# EasyEDA Pro project power_board_24v.epro

# Schematic Power_board_24V
Board Name: Power_board_24V_1; Create Date: 2025-07-09; Page Name: P1; Project Name: metaball; Schematic Name: Power_board_24V_1; Update Date: 2025-07-09; Company: 嘉立创EDA; Drawed: Xudong Han; Page Size: A4; Version: V1.0
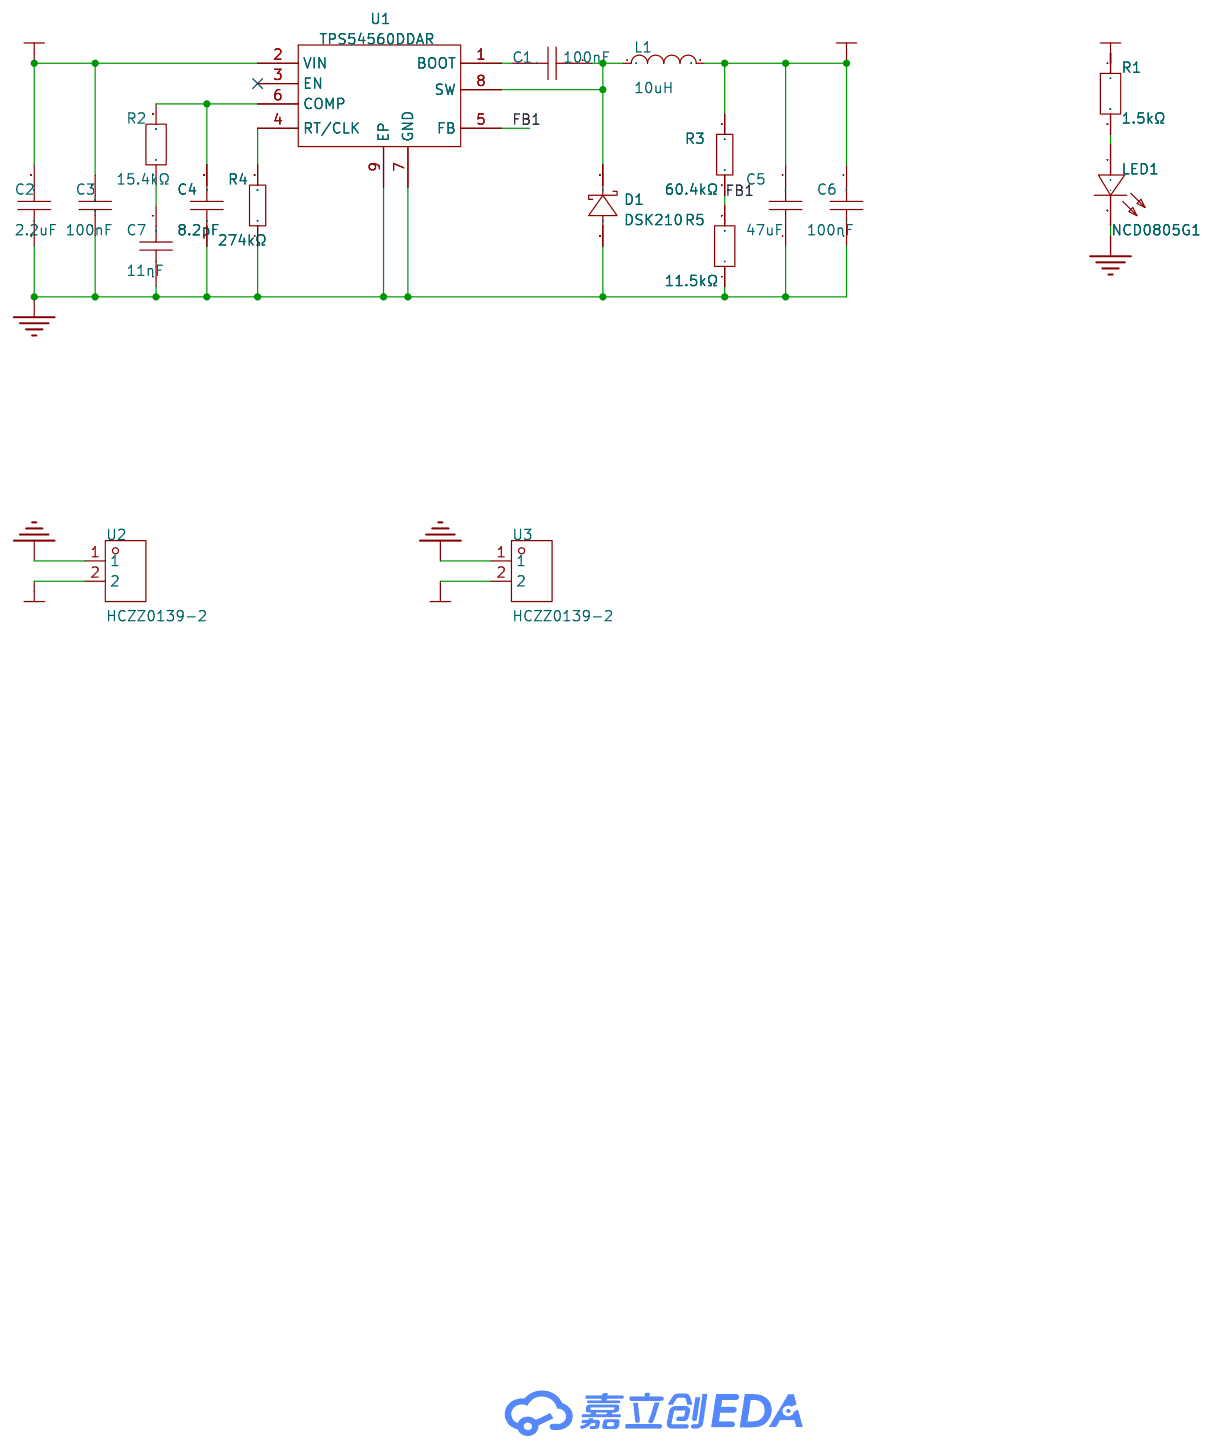
[diagram p0: schematic sheet]

## Parts
C1  100nF  [C0603]
C2  2.2uF  [C0805]
C3  100nF  [C0603]
C4  8.2pF  [C0603]
C5  47uF  [C0805]
C6  100nF  [C0603]
C7  11nF  [C0805]
D1  DSK210  [SOD-123FL_L2.7-W1.8-LS3.8-RD]
L1  10uH  [IND-SMD_L2.5-W2.0_FHD252012S-6R8MT]
LED1  NCD0805G1  [LED0805-R-RD]
R1  1.5kΩ  [R0603]
R2  15.4kΩ  [R0603]
R3  60.4kΩ  [R0603]
R4  274kΩ  [R0603]
R5  11.5kΩ  [R0603]
U1  TPS54560DDAR  [SOIC-8_L5.0-W4.0-P1.27-LS6.0-BL-EP2.0]
U2  HCZZ0139-2  [CONN-TH_2P-P2.50_HCZZ0139-2]
U3  HCZZ0139-2  [CONN-TH_2P-P2.50_HCZZ0139-2]

## Library data of the parts
C1 C6 = CGA0603X7R104K500JT: 容值:100nF;精度:±10%;额定电压:50V;材质(温度系数):X7R;; LCSC Part Name: 100nF ±10% 50V; Supplier Part: C6119867; Manufacturer: HRE(芯声); Supplier Footprint: 0603; JLCPCB Part Class: 扩展库; Supplier: LCSC; Tolerance: ±10%; Voltage Rated: 50V; Temperature Coefficient: X7R
C2 = CL21A225KBQNNNE: 容值:2.2uF;精度:±10%;额定电压:50V;材质(温度系数):X5R;; LCSC Part Name: 2.2uF ±10% 50V; Supplier Part: C377773; Manufacturer: SAMSUNG(三星); Supplier Footprint: 0805; JLCPCB Part Class: Basic Part; Datasheet: https://atta.szlcsc.com/upload/public/pdf/source/20160218/1457707763339.pdf; Supplier: LCSC; Tolerance: ±10%; Voltage Rated: 50V; Temperature Coefficient: X5R
C3 = CGA0603X7R104K500JT: 容值:100nF;精度:±10%;额定电压:50V;温度系数:X7R;; LCSC Part Name: 100nF ±10% 50V; Supplier Part: C6119867; Manufacturer: HRE(芯声); Supplier Footprint: 0603; JLCPCB Part Class: Extended Part; Datasheet: https://atta.szlcsc.com/upload/public/pdf/source/20250103/C44077DA9E7B3EFAE02F22B6D3D1CBC9.pdf; Supplier: LCSC; Tolerance: ±10%; Voltage Rated: 50V; Temperature Coefficient: X7R; Voltage Rating: 50V
C4 = FCC0603N8R2C500CT: 容值:8.2pF;额定电压:50V;材质(温度系数):C0G;; LCSC Part Name: 8.2pF 50V ±0.25pF; Supplier Part: C5137629; Manufacturer: FOJAN(富捷); Supplier Footprint: 0603; JLCPCB Part Class: 扩展库; Datasheet: https://atta.szlcsc.com/upload/public/pdf/source/20220818/0EB3B7FB2F5648AC16609637FBA7DABE.pdf; Supplier: LCSC; Voltage Rated: 50V; Temperature Coefficient: C0G
C5 = CGA0805X5R476M100MT: 容值:47uF;精度:±20%;额定电压:10V;材质(温度系数):X5R;; LCSC Part Name: 47uF ±20% 10V; Supplier Part: C6119904; Manufacturer: HRE(芯声); Supplier Footprint: 0805; JLCPCB Part Class: 扩展库; Supplier: LCSC; Tolerance: ±20%; Voltage Rated: 10V; Temperature Coefficient: X5R
C7 = GRM2195C1H113JA01D: 容值:11nF;精度:±5%;额定电压:50V;材质(温度系数):C0G;; LCSC Part Name: 11nF ±5% 50V; Supplier Part: C710944; Manufacturer: muRata(村田); Supplier Footprint: 0805; JLCPCB Part Class: 扩展库; Datasheet: https://atta.szlcsc.com/upload/public/pdf/source/20230811/93180086841D94E3B53FBD771E074624.pdf; Supplier: LCSC; Tolerance: ±5%; Voltage Rated: 50V; Temperature Coefficient: C0G
D1 = DSK210_C7502713: 二极管配置:独立式;正向压降(Vf):850mV@2A;直流反向耐压(Vr):100V;整流电流:2A;; LCSC Part Name: 电压:100V 电流:2A; Supplier Part: C7502713; Manufacturer: 宏迦橙; Supplier Footprint: SOD-123FL; JLCPCB Part Class: Extended Part; Datasheet: https://atta.szlcsc.com/upload/public/pdf/source/20240814/18366EFEA8C1355349286254791BE851.pdf; Supplier: LCSC; Diode Configuration: 独立式; Forward Voltage (Vf@If): 850mV@2A; Reverse Voltage (Vr): 100V; Rectified Current: 2A; Reverse Leakage Current (Ir): 500uA
L1 = FHD252012S-100MT: 电感值:10uH;精度:±20%;额定电流:1A;饱和电流(Isat):1.35A;类型:绕线电感;; LCSC Part Name: 10uH ±20% 1.35A; Supplier Part: C602018; Manufacturer: cjiang(长江微电); Supplier Footprint: 1008; JLCPCB Part Class: Extended Part; Datasheet: https://atta.szlcsc.com/upload/public/pdf/source/20200609/C601990_BCEA243EC4DA0A9A288AA78A6DFB48A5.pdf; Supplier: LCSC; Tolerance: ±20%; Current Rating: 1A; Current - Saturation(Isat): 1.35A; DC Resistance(DCR): 435mΩ; Type: 绕线电感
LED1 = NCD0805G1: 发光颜色:翠绿色;正向电压(VF):2.5V~3.6V;功率:72mW;正向电流:5mA;主波长:525nm~537.5nm;透镜颜色:无色透明透镜;发光强度:180mcd~400mcd;发光角度:130°;工作温度:-30℃~+85℃;; Supplier Part: C84260; Manufacturer: 国星光电; Supplier Footprint: 0805; JLCPCB Part Class: Extended Part; Datasheet: https://atta.szlcsc.com/upload/public/pdf/source/20200820/C84260_AFC7BF57C6FBA034D182BB8D10A67EFE.pdf; Supplier: LCSC; Emitted Color: 翠绿色; Forward Voltage (VF): 2.5V~3.6V; Power Dissipation: 72mW; Forward Current: 5mA; Dominant Wavelength: 525nm~537.5nm; Lens Color: 无色透明透镜; Luminous Intensity: 180mcd~400mcd; Viewing Angle: 130°; Operating Temperature: -30℃~+85℃
R1 = 0603WAF1501T5E: 电阻类型:厚膜电阻;阻值:1.5kΩ;精度:±1%;功率:100mW;最大工作电压:75V;温度系数:±100ppm/℃;; LCSC Part Name: 1.5kΩ ±1% 100mW 厚膜电阻; Supplier Part: C22843; Manufacturer: UNI-ROYAL(厚声); Supplier Footprint: 0603; JLCPCB Part Class: Basic Part; Datasheet: https://atta.szlcsc.com/upload/public/pdf/source/20200306/C422600_1E6D84923E4A46A82E41ADD87F860B5C.pdf; Supplier: LCSC; Type: 厚膜电阻; Tolerance: ±1%; Power(Watts): 100mW; Overload Voltage (Max): 75V; Temperature Coefficient: ±100ppm/℃; Operating Temperature Range: -55℃~+155℃
R2 = RT0603BRD0715K4L: 电阻类型:薄膜电阻;阻值:15.4kΩ;精度:±0.1%;功率:100mW;温度系数:±25ppm/℃;; LCSC Part Name: 薄膜电阻 15.4kΩ ±0.1% 100mW; Supplier Part: C861142; Manufacturer: YAGEO(国巨); Supplier Footprint: 0603; JLCPCB Part Class: Extended Part; Datasheet: https://atta.szlcsc.com/upload/public/pdf/source/20221229/9BDC4C850F6F9D95EFF69854CFE12DCA.pdf; Supplier: LCSC; Type: 薄膜电阻; Tolerance: ±0.1%; Power(Watts): 100mW; Temperature Coefficient: ±25ppm/℃; Operating Temperature Range: -55℃~+155℃
R3 = 0603WAF6042T5E: 电阻类型:厚膜电阻;阻值:60.4kΩ;精度:±1%;功率:100mW;最大工作电压:75V;温度系数:±100ppm/℃;; LCSC Part Name: 60.4kΩ ±1% 100mW 厚膜电阻; Supplier Part: C23089; Manufacturer: UNI-ROYAL(厚声); Supplier Footprint: 0603; JLCPCB Part Class: 扩展库; Datasheet: https://atta.szlcsc.com/upload/public/pdf/source/20200306/C422600_1E6D84923E4A46A82E41ADD87F860B5C.pdf; Supplier: LCSC; Type: 厚膜电阻; Tolerance: ±1%; Power(Watts): 100mW; Overload Voltage (Max): 75V; Temperature Coefficient: ±100ppm/℃; Operating Temperature Range: -55℃~+155℃
R4 = 0603WAF2743T5E: 电阻类型:厚膜电阻;阻值:274kΩ;精度:±1%;功率:100mW;最大工作电压:75V;温度系数:±100ppm/℃;; LCSC Part Name: 274kΩ ±1% 100mW 厚膜电阻; Supplier Part: C22968; Manufacturer: UNI-ROYAL(厚声); Supplier Footprint: 0603; JLCPCB Part Class: 扩展库; Datasheet: https://atta.szlcsc.com/upload/public/pdf/source/20200306/C422600_1E6D84923E4A46A82E41ADD87F860B5C.pdf; Supplier: LCSC; Type: 厚膜电阻; Tolerance: ±1%; Power(Watts): 100mW; Overload Voltage (Max): 75V; Temperature Coefficient: ±100ppm/℃; Operating Temperature Range: -55℃~+155℃
R5 = FRC0603F1152TS: 电阻类型:厚膜电阻;阻值:11.5kΩ;精度:±1%;功率:100mW;最大工作电压:75V;温度系数:±100ppm/℃;; LCSC Part Name: 11.5kΩ ±1% 100mW 厚膜电阻; Supplier Part: C2930057; Manufacturer: FOJAN(富捷); Supplier Footprint: 0603; JLCPCB Part Class: 扩展库; Datasheet: https://atta.szlcsc.com/upload/public/pdf/source/20211221/925EC7D7225764EE0046F22065062C87.pdf; Supplier: LCSC; Type: 厚膜电阻; Tolerance: ±1%; Power(Watts): 100mW; Overload Voltage (Max): 75V; Temperature Coefficient: ±100ppm/℃; Operating Temperature Range: -55℃~+155℃
U1 = TPS54560DDAR: 功能类型:降压型;输出类型:可调;工作电压:4.5V~60V;输出电压:800mV~58.8V;输出电流:5A;; LCSC Part Name: 4.5V至60V输入,5A降压DC-DC转换器; Supplier Part: C31966; Manufacturer: TI(德州仪器); Supplier Footprint: SOIC-8-EP; JLCPCB Part Class: 扩展库; Datasheet: https://www.ti.com/cn/lit/gpn/tps54560; Supplier: LCSC; Function: 降压型; Output Type: 可调; Input Voltage: 4.5V~60V; Output Voltage: 800mV~58.8V; Output Current: 5A; Switching Frequency: 2.5MHz; Operating Temperature: -40℃~+150℃@(TJ); Synchronous Rectification: 否; Number of Outputs: 1; Topology: 降压式; Switch tube (built-in/external): 内置
U2 = HCZZ0139-2: 插针结构:1x2P;间距:2.5mm;安装方式:弯插;参考系列:XH;总PIN数:2P;排数:1;每排PIN数:2;行距:-;额定电流:3A;触头材质:铜;触头镀层:锡;工作温度:-25℃~+85℃;; LCSC Part Name: 米色 1x2P 间距:2.54mm 弯插 系列:XH 插件铜; Supplier Part: C7433737; Manufacturer: HC(虹成电子); Supplier Footprint: 弯插,p=2.54mm; JLCPCB Part Class: Extended Part; Datasheet: https://atta.szlcsc.com/upload/public/pdf/source/20250106/6A13C004BF7761902930F510FA899E7C.pdf; Supplier: LCSC; Pins Structure: 1x2P; Pitch: 2.5mm; Mounting Type: 弯插; Reference Series: XH; Number of Pins: 2P; Number of Rows: 1; Number of PINs Per Row: 2; Current Rating: 3A; Contact Material: 铜; Contact Plating: 锡; Operating Temperature: -25℃~+85℃; Voltage Rating: 250V; Plastic Material: PA66; Color: 米色; Z-Height of the Board: 5.8mm; X-Length of Bottom Edge on Board (Spacing Line): 7.5mm; Y-Width of Bottom Edge on Board: 7mm
U3 = HCZZ0139-2: 插针结构:1x2P;间距:2.5mm;安装方式:弯插;参考系列:XH;总PIN数:2P;排数:1;每排PIN数:2;行距:-;额定电流:3A;触头材质:铜;触头镀层:锡;工作温度:-25℃~+85℃;; LCSC Part Name: 米色 1x2P 间距:2.54mm 弯插 系列:XH 插件铜; Supplier Part: C7433737; Manufacturer: HC(虹成电子); Supplier Footprint: 弯插,p=2.54mm; JLCPCB Part Class: 扩展库; Datasheet: https://atta.szlcsc.com/upload/public/pdf/source/20250106/6A13C004BF7761902930F510FA899E7C.pdf; Supplier: LCSC; Pins Structure: 1x2P; Pitch: 2.5mm; Mounting Type: 弯插; Reference Series: XH; Number of Pins: 2P; Number of Rows: 1; Number of PINs Per Row: 2; Current Rating: 3A; Contact Material: 铜; Contact Plating: 锡; Operating Temperature: -25℃~+85℃; Voltage Rating: 250V; Plastic Material: PA66; Color: 米色; Z-Height of the Board: 5.8mm; X-Length of Bottom Edge on Board (Spacing Line): 7.5mm; Y-Width of Bottom Edge on Board: 7mm

## Nets
5V: C5.2 C6.2 L1.2 R1.1 R3.2 U3.2
24V: C2.2 C3.2 U1.2(VIN) U2.2
GND: C2.1 C3.1 C4.1 C5.1 C6.1 C7.1 D1.2(A) LED1.2(-) R4.1 R5.1 U1.7(GND) U1.9(EP) U2.1 U3.1
FB1: R3.1 R5.2 U1.5(FB)
$1N1008: LED1.1(+) R1.2
$1N1011: C4.2 R2.2 U1.6(COMP)
$1N1012: C7.2 R2.1
$1N1014: C1.1 U1.1(BOOT)
$1N1015: C1.2 D1.1(K) L1.1 U1.8(SW)
$1N1019: R4.2 U1.4(RT/CLK)

Not connected (* = marked no-connect by the designer): U1 3(EN)*

# Board Power_board_24V
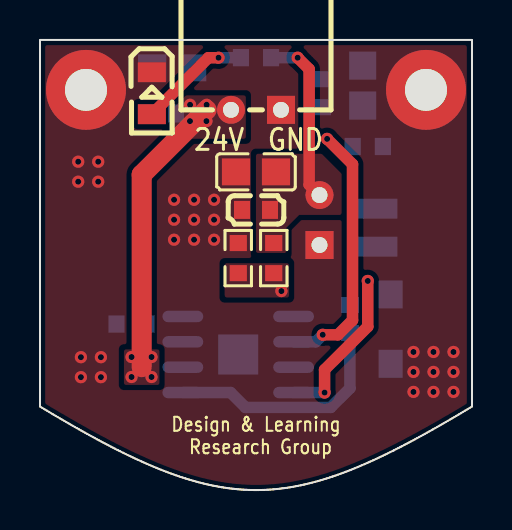
[diagram p1: board, top side]
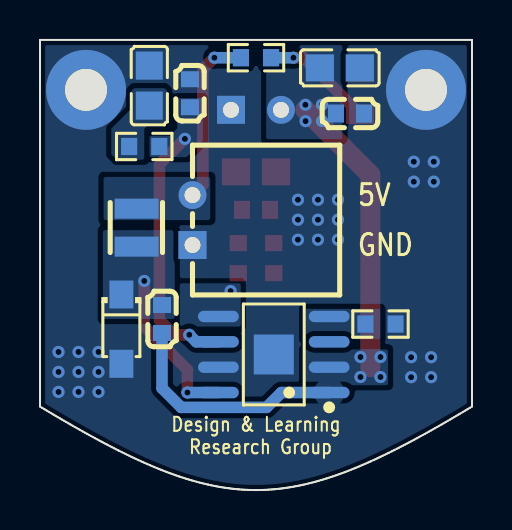
[diagram p2: board, bottom side, seen from below]

Outline 21.6 x 22.53 mm; copper layers: Top Layer, Bottom Layer. Coordinates in mm from the lower left corner of the outline.
Outline path: 0,22.53 0,4.18 0.11,4.11 0.23,4.04 0.34,3.98 0.45,3.91 0.67,3.78 0.78,3.72 0.89,3.65 1,3.59 1.11,3.52 1.32,3.4 1.53,3.28 1.64,3.22 1.74,3.16 1.84,3.1 1.95,3.04 2.05,2.98 2.15,2.92 2.26,2.87 2.36,2.81 2.46,2.76 2.56,2.7 2.66,2.65 2.76,2.59 2.86,2.54 2.96,2.49 3.05,2.43 3.15,2.38 3.25,2.33 3.34,2.28 3.44,2.23 3.54,2.18 3.63,2.13 3.73,2.08 3.91,1.99 4.01,1.94 4.19,1.85 4.29,1.8 4.38,1.76 4.47,1.71 4.56,1.67 4.65,1.63 4.74,1.58 4.83,1.54 4.92,1.5 5.1,1.42 5.19,1.38 5.28,1.34 5.36,1.3 5.45,1.27 5.54,1.23 5.62,1.19 5.71,1.16 5.8,1.12 5.88,1.08 5.97,1.05 6.05,1.02 6.22,0.95 6.31,0.92 6.39,0.89 6.47,0.85 6.56,0.82 6.64,0.79 6.72,0.77 6.8,0.74 6.89,0.71 6.97,0.68 7.05,0.65 7.13,0.63 7.29,0.57 7.37,0.55 7.46,0.52 7.54,0.5 7.7,0.45 7.78,0.43 7.85,0.41 7.93,0.39 8.01,0.37 8.09,0.35 8.17,0.33 8.25,0.31 8.33,0.29 8.48,0.26 8.56,0.24 8.64,0.22 8.72,0.21 8.79,0.19 8.87,0.18 8.95,0.17 9.1,0.14 9.26,0.12 9.33,0.1 9.41,0.09 9.49,0.08 9.56,0.07 9.71,0.06 9.87,0.04 9.94,0.04 10.02,0.03 10.09,0.02 10.17,0.02 10.25,0.02 10.32,0.01 10.47,0 10.55,0 10.62,0 10.7,0 10.78,0 10.85,0 10.93,0 11.08,0 11.23,0.01 11.3,0.01 11.38,0.02 11.46,0.02 11.53,0.03 11.68,0.04 11.76,0.04 11.84,0.05 11.91,0.06 11.99,0.07 12.06,0.08 12.14,0.09 12.22,0.1 12.29,0.11 12.37,0.12 12.45,0.13 12.6,0.16 12.68,0.17 12.75,0.18 12.83,0.2 12.91,0.21 13.06,0.24 13.22,0.28 13.3,0.3 13.38,0.31 13.45,0.33 13.53,0.35 13.61,0.37 13.77,0.41 13.93,0.46 14.01,0.48 14.09,0.51 14.17,0.53 14.25,0.55 14.33,0.58 14.41,0.6 14.49,0.63 14.65,0.68 14.74,0.71 14.82,0.74 14.9,0.77 14.98,0.8 15.06,0.83 15.15,0.86 15.23,0.89 15.31,0.92 15.4,0.96 15.48,0.99 15.57,1.02 15.74,1.09 15.91,1.16 16,1.2 16.08,1.23 16.26,1.31 16.34,1.35 16.52,1.43 16.79,1.55 16.88,1.59 16.97,1.63 17.06,1.68 17.15,1.72 17.24,1.76 17.33,1.81 17.42,1.85 17.51,1.9 17.7,1.99 17.79,2.04 17.89,2.09 17.98,2.14 18.08,2.18 18.36,2.33 18.46,2.39 18.56,2.44 18.66,2.49 18.75,2.54 18.85,2.6 18.95,2.65 19.05,2.7 19.15,2.76 19.25,2.82 19.35,2.87 19.66,3.04 19.76,3.1 19.97,3.22 20.07,3.28 20.18,3.34 20.29,3.4 20.39,3.46 20.5,3.53 20.61,3.59 20.82,3.72 21.04,3.85 21.15,3.91 21.26,3.98 21.38,4.05 21.49,4.11 21.6,4.18 21.6,22.53 0,22.53
Stack: Top Layer 0.035mm / Dielectric1 1.51mm FR4 er 4.5 / Bottom Layer 0.035mm

## Design rules (mm)
template: 自定义配置
spacing copperThickness1oz (default): track to track 0.102, other pairs 0.152 to 0.3
spacing copperThickness2oz: track to track 0.203, other pairs 0.152 to 0.3
track width copperThickness1oz (default): min 0.127, default 0.254, max 2.54
track width copperThickness2oz: min 0.203, default 0.254, max 2.54
differential pair differentialPair (default): width min 0.127, default 0.254, max 2.54; gap min 0.152, default 0.152
via viaSize (default): diameter min 0.5, default 0.61, max 10; hole min 0.3, default 0.305, max 6.3

## Placement (name value [footprint] x y rotation side)
C1  100nF  [C0603]  15.5 8.56 90 bottom
C2  2.2uF  [C0805]  6.61 21.14 0 bottom
C3  100nF  [C0603]  6.1 18.85 0 bottom
C4  8.2pF  [C0603]  14.1 19.87 270 bottom
C5  47uF  [C0805]  10.8 15.93 0 top
C6  100nF  [C0603]  10.8 14.03 0 top
C7  11nF  [C0805]  16.13 20.25 270 bottom
D1  DSK210  [SOD-123FL_L2.7-W1.8-LS3.8-RD]  17.53 8.06 270 bottom
L1  10uH  [IND-SMD_L2.5-W2.0_FHD252012S-6R8MT]  16.77 13.14 90 bottom
LED1  NCD0805G1  [LED0805-R-RD]  5.59 19.87 270 top
NOREF  -  [Pad_e366]  2.3 20.03 0 top
NOREF#2  -  [Pad_e364]  19.3 20.03 0 top
R1  1.5kΩ  [R0603]  10.8 21.65 180 bottom
R2  15.4kΩ  [R0603]  16.39 17.2 180 bottom
R3  60.4kΩ  [R0603]  11.69 11.61 90 top
R4  274kΩ  [R0603]  4.58 8.31 0 bottom
R5  11.5kΩ  [R0603]  9.91 11.61 270 top
U1  TPS54560DDAR  [SOIC-8_L5.0-W4.0-P1.27-LS6.0-BL-EP2.0]  9.91 6.79 90 bottom
U2  HCZZ0139-2  [CONN-TH_2P-P2.50_HCZZ0139-2]  10.8 19.03 180 top
U3  HCZZ0139-2  [CONN-TH_2P-P2.50_HCZZ0139-2]  13.98 13.52 90 bottom

## Footprints (pads in the part's own frame, mm; a bottom-side part is the same pattern mirrored in y, then rotated)
C0603
  rect 0.8x0.9 smd: 1(-0.7,0) 2(0.7,0)
C0805
  rect 1.41x1.35 smd: 1(-1,0) 2(1,0)
CONN-TH_2P-P2.50_HCZZ0139-2
  rect 1.4x1.4 hole 0.8: 1(-1.25,0)
  round 1.4 hole 0.8: 2(1.25,0)
IND-SMD_L2.5-W2.0_FHD252012S-6R8MT
  rect 1x2.2 smd: 1(-0.951,0) 2(0.951,0)
LED0805-R-RD
  rect 1x1.399 smd: 1(1.05,0) 2(-1.05,0)
Pad_e364
  round 4 hole 2.1: 1(0,0)
Pad_e366
  round 4 hole 2.1: 1(0,0)
R0603
  rect 0.806x0.864 smd: 1(-0.753,0) 2(0.753,0)
SOD-123FL_L2.7-W1.8-LS3.8-RD
  rect 1.4x1.2 smd: 1(-1.735,0) 2(1.735,0)
SOIC-8_L5.0-W4.0-P1.27-LS6.0-BL-EP2.0
  oval 0.574x2.038 smd: 1(-1.905,-2.769) 2(-0.635,-2.769) 3(0.635,-2.769) 4(1.905,-2.769) 5(1.905,2.769) 6(0.635,2.769) 7(-0.635,2.769) 8(-1.905,2.769)
  rect 2x2 smd: 9(0,0)

## Nets
As in the schematic, except:
GND: C2.1 C3.1 C4.1 C5.1 C6.1 C7.1 D1.2 LED1.2 NOREF.1 NOREF#2.1 R4.1 R5.1 U1.7 U1.9 U2.1 U3.1

Pads without a net: U1 3

## Via types
v1: diameter 0.61, hole 0.305, Top Layer to Bottom Layer, 41 vias

## Routing (per net, layer and track width the routed paths; a pad name or vN(x,y) marks a point on that pad's centre or on a via; arc(x,y) is an arc through that point)
5V: length 8.7
  Top Layer w0.574: U3.2 13.46,15.29 13.46,21.07 v1(12.88,21.65)
  Bottom Layer w0.574: R1.1 v1(12.88,21.65)
24V: length 14.2
  Top Layer w1: 8.33,19.03 5.09,15.79 5.09,6.15
  vias: v1(4.58,6.66) v1(4.58,5.66) v1(5.58,6.66) v1(5.58,5.66) v1(7.5,19.29) v1(7.5,18.47) v1(8.33,19.29) v1(8.32,18.47)
GND:
  vias: v1(1.91,16.44) v1(1.91,15.44) v1(2.05,6.65) v1(2.05,5.65) v1(2.91,16.44) v1(2.91,15.44) v1(3.05,6.65) v1(3.05,5.65) v1(6.7,14.53) v1(6.7,13.53) v1(6.7,12.53) v1(7.7,14.53) v1(7.7,13.53) v1(7.7,12.53) v1(8.7,14.53) v1(8.7,13.53) v1(8.7,12.53) v1(18.67,6.91) v1(18.67,5.91) v1(18.67,4.91) v1(19.67,6.91) v1(19.67,5.91) v1(19.67,4.91) v1(20.67,6.91) v1(20.67,5.91) v1(20.67,4.91)
FB1:
  vias: v1(12.07,9.96)
$1N1008: length 5.6
  Top Layer w0.574: v1(8.93,21.65) 8.42,21.65 LED1.1
  Bottom Layer w0.574: R1.2 v1(8.93,21.65)
$1N1011: length 13
  Top Layer w0.574: v1(14.36,17.58) 15.63,16.31 15.63,8.5 14.9,7.77 v1(14.14,7.77)
  Bottom Layer w0.574: U1.6 13.78,7.42 v1(14.14,7.77)
$1N1014: length 11.8
  Bottom Layer w0.574: U1.1 9.53,4.88 10.27,4.14 14.54,4.14 15.5,5.1 C1.1
$1N1015: length 8
  Top Layer w0.574: v1(16.39,10.47) 16.39,8.18 14.23,6.02 v1(14.23,4.88)
  Bottom Layer w0.574: U1.8 v1(14.23,4.88)

## Copper pours and planes (outline as drawn; the poured copper is in the pictures)
5V on Top Layer: 10.8,16.83 14.29,16.83 15.2,15.93 15.2,13.77 12.96,13.77 12.32,13.14 12.32,11.83 10.8,11.83
5V on Bottom Layer: 13.09,15.68 18.42,15.68 18.42,13.52 13.09,13.52
24V on Top Layer: 6.54,19.76 10.29,19.76 10.29,17.59 6.54,17.59
24V on Top Layer: 4.2,7.04 5.97,7.04 5.97,5.26 4.2,5.26
24V on Bottom Layer: 6.48,22.53 10.29,22.53 10.29,17.56 6.48,17.56
24V on Bottom Layer: 4.2,7.04 8.39,7.04 8.39,5.25 4.2,5.25
GND on Top Layer: -1.65,24.69 23.37,24.69 23.37,-2.87 -1.65,-2.87
GND on Bottom Layer: -1.65,24.69 23.37,24.69 23.37,-2.87 -1.65,-2.87
FB1 on Top Layer: 9.23,11.36 12.45,11.36 12.45,9.64 9.23,9.64
FB1 on Bottom Layer: 11.56,10.35 14.61,10.35 14.61,8.18 11.56,8.18
$1N1011 on Bottom Layer: 13.46,19.62 14.74,19.62 14.74,18.11 15.11,17.73 16.11,17.73 16.13,17.71 16.13,16.71 16.09,16.67 14.27,16.67 13.46,17.48
$1N1012 on Bottom Layer: 16.39,16.54 17.77,16.54 18.04,16.81 18.04,18.09 17.04,19.09 17.04,19.98 16.9,20.12 15.37,20.12 15.25,19.99 15.25,18.47 15.37,18.34 16.13,18.34 16.39,18.09
$1N1015 on Bottom Layer: 14.86,13.01 18.46,13.01 18.46,8.56 14.86,8.56
$1N1019 on Bottom Layer: 4.58,9.07 8.39,9.07 8.39,7.55 4.58,7.55

## Text on the board
Bottom Silkscreen Layer: Design & Learning / Research Group | 5V | GND
Top Silkscreen Layer: Design & Learning / Research Group | GND | 24V
